# EAGLE design alimentacion_piano_bateria (EAGLE 5.11)
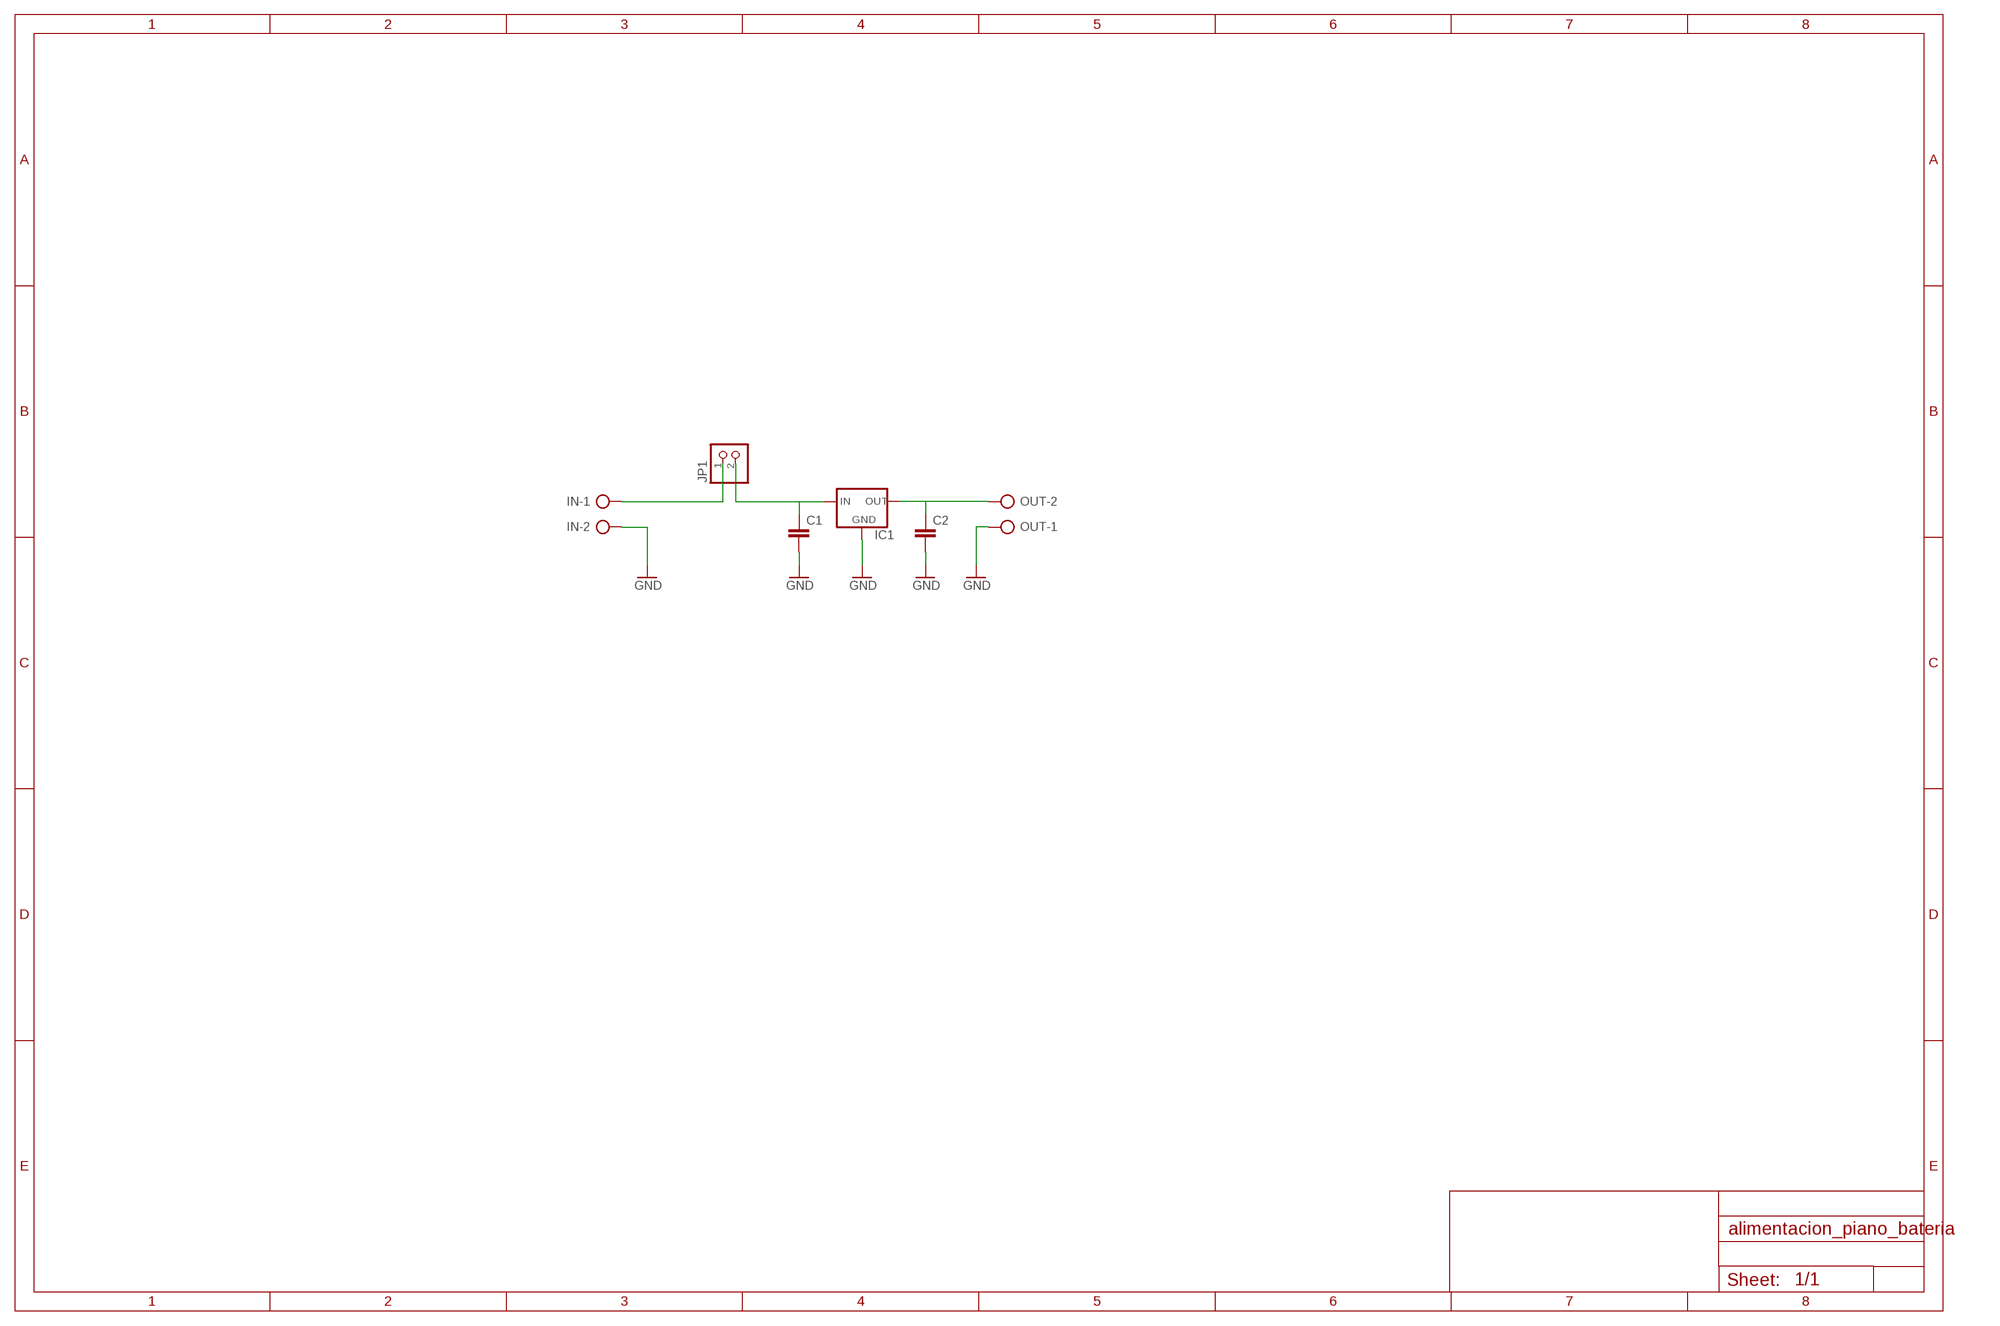
[diagram p0: schematic, sheet 1]

## Parts
C1  C-EU025-030X050  [C025-030X050]
C2  C-EU025-030X050  [C025-030X050]
IC1  78XXS  [78XXS]
IN  AK300/2  [AK300/2]
JP1  PINHD-1X2  [1X02]
OUT  AK300/2  [AK300/2]

## Nets
GND: C1.2 C2.2 IC1.GND IN.2 OUT.1
N$1: C2.1 IC1.OUT OUT.2
N$2: IN.1 JP1.1
N$3: C1.1 IC1.IN JP1.2

## Library data of the parts
C1 C2 = rcl:C-EU: CAPACITOR, European symbol
IC1 = v-reg:78XXS: VOLTAGE REGULATOR
IN OUT = con-ptr500:AK300/2: CONNECTOR; OC_FARNELL: unknown; OC_NEWARK: unknown
JP1 = pinhead:PINHD-1X2: PIN HEADER

## Board
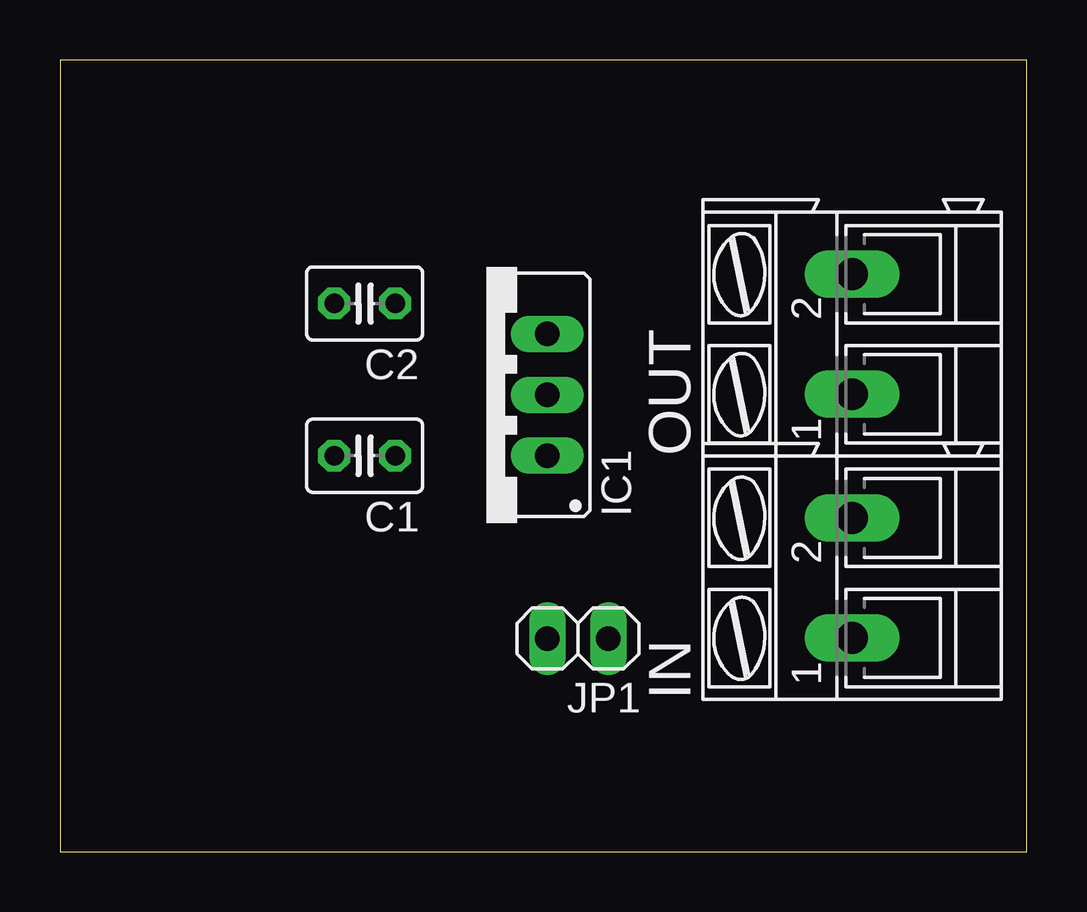
[diagram p1: board, top side]
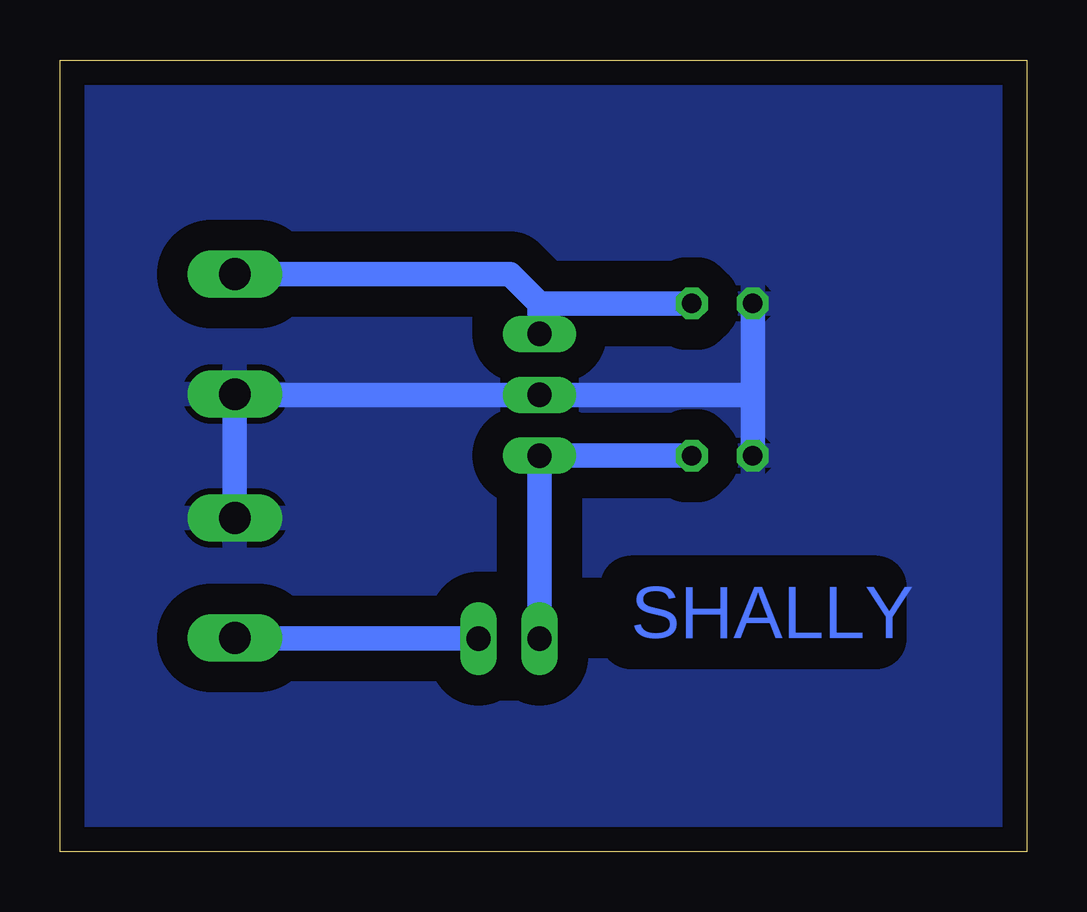
[diagram p2: board, bottom side, seen from below]

Size 40.31 x 33.01 mm. Coordinates in mm from the lower left corner, seen from the top.
Outline: 0,0 40.31,0 40.31,33.01 0,33.01 0,0
Copper layers (1*16): Top 0.035mm / dielectric 1.5mm / Bottom 0.035mm
Design rules "default *": minimum track width 10mil, minimum drill 24mil, track to track 50mil, track to pad 50mil, pad to pad 50mil, via to via 8mil, smd to smd 8mil, copper to edge 40mil, drill to drill 8mil, minimum pad ring 10mil, minimum via ring 8mil, stop-mask expansion 4mil, vias tented up to drill 0mil, thermal gap 10mil

### Footprints (pad centres in the part's own frame; a part is rotated, then mirrored left to right if it is on the bottom)
C025-030X050 = drill 0.813 octagon: 1 -1.27,0; 2 1.27,0
78XXS = drill 1.016 long: GND 0,-2.54; IN -2.54,-2.54; OUT 2.54,-2.54
AK300/2 = drill 1.321 long: 1 -2.515,0; 2 2.489,0
1X02 = drill 1.016 long: 1 -1.27,0; 2 1.27,0

### Placement (x,y rotation side)
C1  12.7,16.51 180 top
C2  12.7,22.86 180 top
IC1  17.78,19.05 90 top
IN  33.02,11.43 90 top
JP1  21.59,8.89 180 top
OUT  33.02,21.59 90 top

### Tracks (layer width: path | path; a pad name or v marks a point on that pad's centre or on a via)
GND
  Bottom 1.016: IN.2 OUT.1 32.99,19.05 IC1.GND 11.43,19.05 | C1.2 11.43,19.05 | 11.43,19.05 C2.2
  pour Bottom: 5.08,31.75 0,31.75 0,29.21 0,0 40.64,0 40.64,33.02 5.08,33.02
N$1
  Bottom 1.016: OUT.2 21.54,24.08 20.32,22.86 | 20.32,22.86 IC1.OUT | C2.1 20.32,22.86
N$2
  Bottom 1.016: JP1.1 33.02,8.89 IN.1
N$3
  Bottom 1.016: C1.1 IC1.IN JP1.2

### Text on the board
Bottom: SHALLY